# Altium schematic sheet sparkfun-samd21-mini-breakout.SchDoc
size 274 x 209 mm
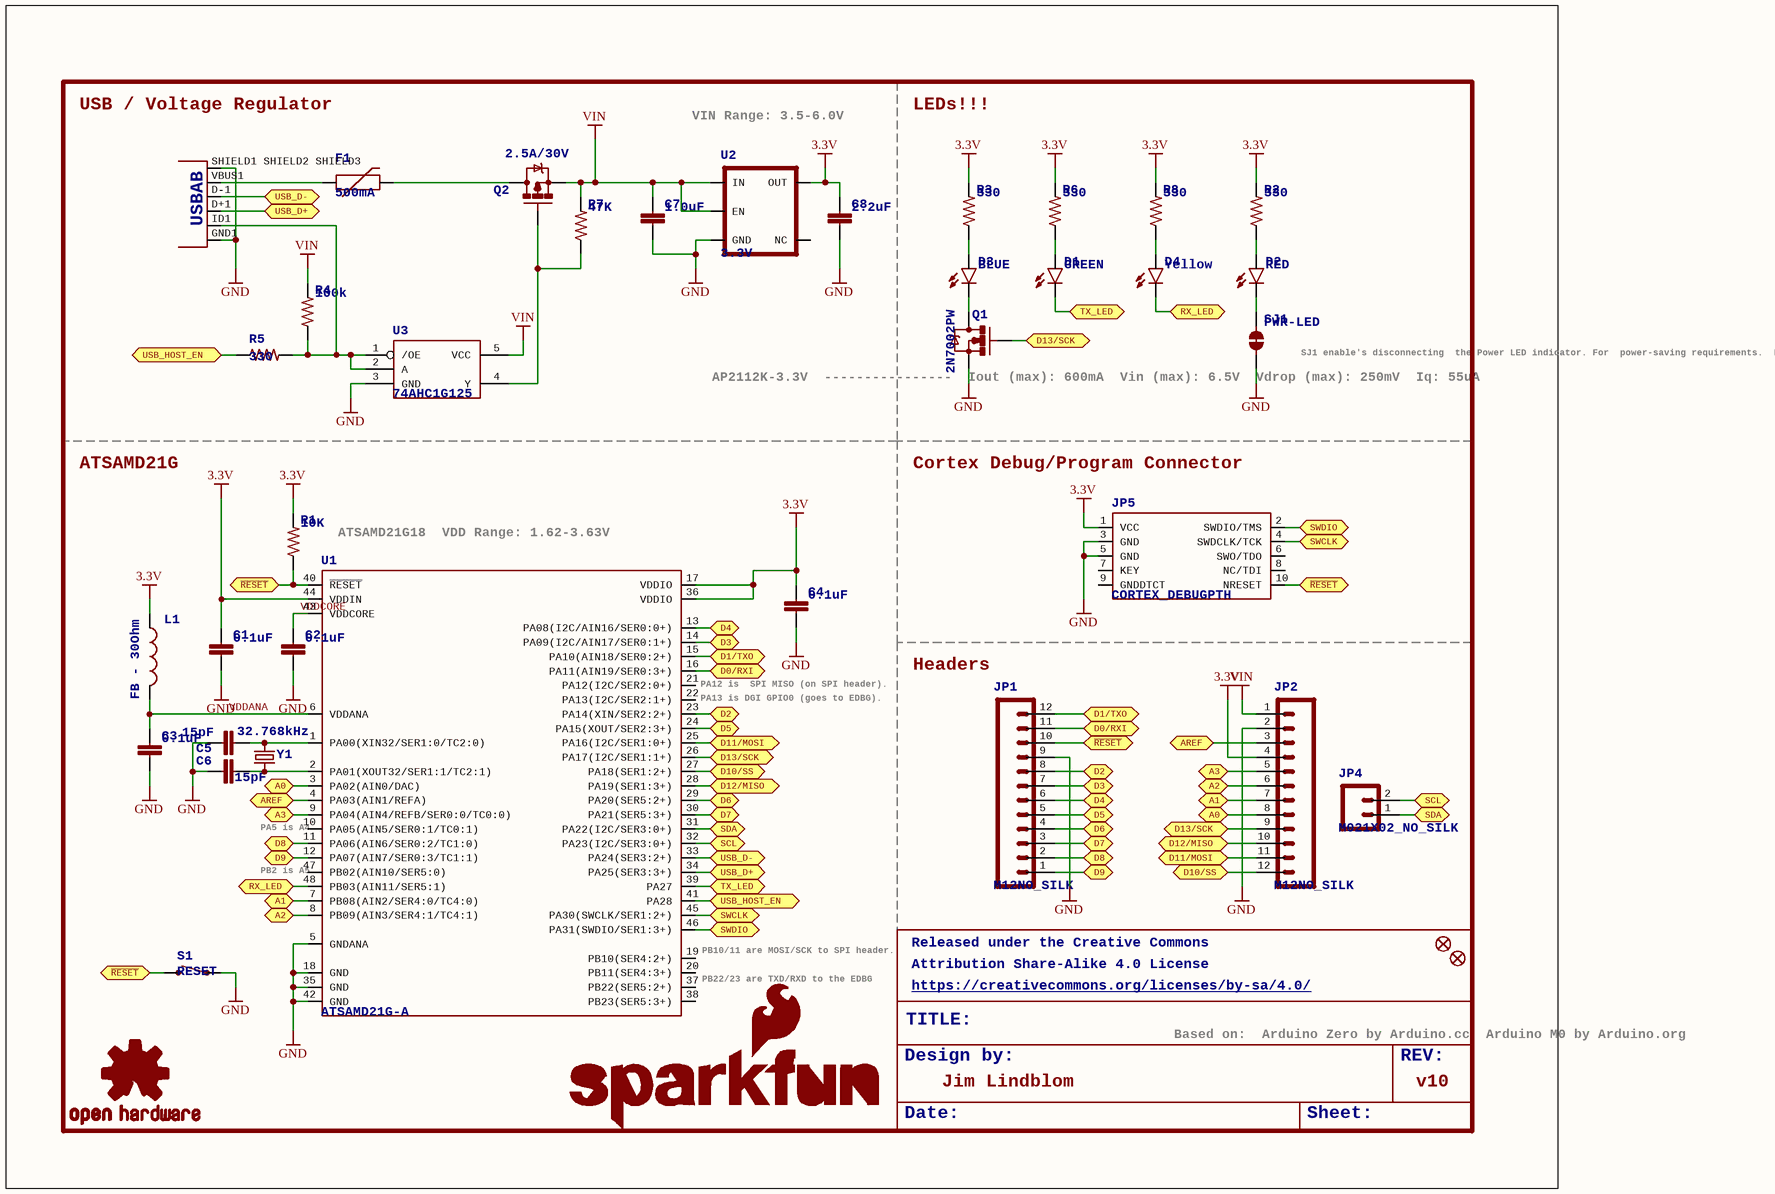
[diagram p0: sparkfun-samd21-mini-breakout.SchDoc]

## Parts
C1  0.1uF  [0402-CAP]
C2  0.1uF  [0402-CAP]
C3  0.1uF  [0402-CAP]
C4  0.1uF  [0402-CAP]
C5  15pF  [0402-CAP]
C6  15pF  [0402-CAP]
C7  1.0uF  [0805-CAP]
C8  2.2uF  [0603-CAP]
D1  GREEN  [LED-0603]
D2  RED  [LED-0603]
D3  BLUE  [LED-0603]
D4  Yellow  [LED-0603]
F1  500mA  [PTC-1206]
FID1  FIDUCIAL1X2  [FIDUCIAL-1X2]  (value not drawn)
FID2  FIDUCIAL1X2  [FIDUCIAL-1X2]  (value not drawn)
JP1  M12NO_SILK  [1X12_NO_SILK]
JP2  M12NO_SILK  [1X12_NO_SILK]
JP3  USB-ABCONN-11794  [USB-AB-MICRO-SMD_V03]  (value not drawn)
JP4  M021X02_NO_SILK  [1X02_NO_SILK]
JP5  CORTEX_DEBUGPTH  [2X5-PTH-1.27MM]
L1  FB - 30Ohm  [0603]
LOGO1  SFE_LOGO_FLAME.1_INCH  [SFE_LOGO_FLAME_.1]  (value not drawn)
LOGO2  OSHW-LOGOS  [OSHW-LOGO-S]  (value not drawn)
LOGO3  SFE_LOGO_NAME_FLAME.1_INCH  [SFE_LOGO_NAME_FLAME_.1]  (value not drawn)
Q1  2N7002PW  [SOT323]
Q2  2.5A/30V  [SOT23-3]
R1  10K  [0603-RES]
R2  330  [0603-RES]
R3  330  [0603-RES]
R4  100k  [0603-RES]
R5  330  [0603-RES]
R6  330  [0603-RES]
R7  47K  [0603-RES]
R8  330  [0603-RES]
S1  RESET  [TACTILE_SWITCH_SMD_4.6X2.8MM]
SJ1  PWR-LED  [PAD-JUMPER-2-NC_BY_TRACE_NO_SILK]
U1  ATSAMD21G-A  [TQFP-48]
U2  3.3V  [SOT23-5]
U3  74AHC1G125  [SOT23-5]
Y1  32.768kHz  [CRYSTAL-SMD-3.2X1.5MM]

## Ports
A0, A1, A2, A3, AREF, D0/RXI, D1/TXO, D2, D3, D4, D5, D6, D7, D8, D9, D10/SS, D11/MOSI, D12/MISO, D13/SCK, RX_LED, SCL, SDA, SWCLK, SWDIO, TX_LED, USB_D+, USB_D-, USB_HOST_EN, ~{RESET}

## Nets
3.3V: C1.1 C4.1 C8.1 JP2.4 JP5.1(VCC) L1.1 R1.2 R2.2 R3.2 R6.2 R8.2 U1.17(VDDIO) U1.36(VDDIO) U1.44(VDDIN) U2.5(OUT)
GND: C1.2 C2.2 C3.2 C4.2 C5.1 C6.2 C7.2 C8.2 JP1.9 JP2.2 JP3.GND1(GND) JP3.SHIELD1_SHIELD2_SHIELD3(SHIELD) JP5.3(GND) JP5.5(GND) Q1.2(S) S1.1_2 SJ1.1 U1.5(GNDANA) U1.18(GND) U1.35(GND) U1.42(GND) U2.2(GND) U3.3(GND)
VIN: C7.1 JP2.1 Q2.2(S) R4.2 R7.2 U2.1(IN) U2.3(EN) U3.5(VCC)
A0: JP2.8 U1.3(PA02(AIN0/DAC)) ; port A0
A1: JP2.7 U1.7(PB08(AIN2/SER4:0/TC4:0)) ; port A1
A2: JP2.6 U1.8(PB09(AIN3/SER4:1/TC4:1)) ; port A2
A3: JP2.5 U1.9(PA04(AIN4/REFB/SER0:0/TC0:0)) ; port A3
AREF: JP2.3 U1.4(PA03(AIN1/REFA)) ; port AREF
D0/RXI: JP1.11 U1.16(PA11(AIN19/SER0:3+)) ; port D0/RXI
D1/TXO: JP1.12 U1.15(PA10(AIN18/SER0:2+)) ; port D1/TXO
D2: JP1.8 U1.23(PA14(XIN/SER2:2+)) ; port D2
D3: JP1.7 U1.14(PA09(I2C/AIN17/SER0:1+)) ; port D3
D4: JP1.6 U1.13(PA08(I2C/AIN16/SER0:0+)) ; port D4
D5: JP1.5 U1.24(PA15(XOUT/SER2:3+)) ; port D5
D6: JP1.4 U1.29(PA20(SER5:2+)) ; port D6
D7: JP1.3 U1.30(PA21(SER5:3+)) ; port D7
D8: JP1.2 U1.11(PA06(AIN6/SER0:2/TC1:0)) ; port D8
D9: JP1.1 U1.12(PA07(AIN7/SER0:3/TC1:1)) ; port D9
D10/SS: JP2.12 U1.27(PA18(SER1:2+)) ; port D10/SS
D11/MOSI: JP2.11 U1.25(PA16(I2C/SER1:0+)) ; port D11/MOSI
D12/MISO: JP2.10 U1.28(PA19(SER1:3+)) ; port D12/MISO
D13/SCK: JP2.9 Q1.1(G) U1.26(PA17(I2C/SER1:1+)) ; port D13/SCK
~{RESET}: JP1.10 JP5.10(NRESET) R1.1 S1.3_4 U1.40(~{RESET}) ; port ~{RESET}
RX_LED: D4.C U1.48(PB03(AIN11/SER5:1)) ; port RX_LED
SCL: JP4.2 U1.32(PA23(I2C/SER3:0+)) ; port SCL
SDA: JP4.1 U1.31(PA22(I2C/SER3:0+)) ; port SDA
SWCLK: JP5.4(SWDCLK/TCK) U1.45(PA30(SWCLK/SER1:2+)) ; port SWCLK
SWDIO: JP5.2(SWDIO/TMS) U1.46(PA31(SWDIO/SER1:3+)) ; port SWDIO
TX_LED: D1.C U1.39(PA27) ; port TX_LED
USB_D+: JP3.D+1(D+) U1.34(PA25(SER3:3+)) ; port USB_D+
USB_D-: JP3.D-1(D-) U1.33(PA24(SER3:2+)) ; port USB_D-
USB_HOST_EN: R5.1 U1.41(PA28) ; port USB_HOST_EN
VDDANA: C3.1 L1.2 U1.6(VDDANA)
VDDCORE: C2.1 U1.43(VDDCORE)
NetC5_2: C5.2 U1.1(PA00(XIN32/SER1:0/TC2:0)) Y1.P$2
NetC6_1: C6.1 U1.2(PA01(XOUT32/SER1:1/TC2:1)) Y1.P$1
NetD1_A: D1.A R6.1
NetD2_A: D2.A R2.1
NetD2_C: D2.C SJ1.2
NetD3_A: D3.A R3.1
NetD3_C: D3.C Q1.3(D)
NetD4_A: D4.A R8.1
NetF1_1: F1.1 JP3.VBUS1(VBUS)
NetF1_2: F1.2 Q2.3(D)
NetJP3_ID1: JP3.ID1(USBID) R4.1 R5.2 U3.1(/OE) U3.2(A)
NetQ2_1: Q2.1(G) R7.1 U3.4(Y)

Not connected (* = marked no-connect by the designer): JP5 6(SWO/TDO) 7(KEY) 8(NC/TDI) 9(GNDDTCT); U1 10(PA05(AIN5/SER0:1/TC0:1)) 19(PB10(SER4:2+)) 20(PB11(SER4:3+)) 21(PA12(I2C/SER2:0+)) 22(PA13(I2C/SER2:1+)) 37(PB22(SER5:2+)) 38(PB23(SER5:3+)) 47(PB02(AIN10/SER5:0)); U2 4(NC)

## Notes on the sheet
- USB / Voltage Regulator
- VIN Range: 3.5-6.0V
- LEDs!!!
- (near SJ1) SJ1 enable's disconnecting
  the Power LED indicator. For
  power-saving requirements.
  Default: closed.
- AP2112K-3.3V
  ----------------
  Iout (max): 600mA
  Vin (max): 6.5V
  Vdrop (max): 250mV
  Iq: 55uA
- ATSAMD21G
- (near JP5) Cortex Debug/Program Connector
- ATSAMD21G18
  VDD Range: 1.62-3.63V
- (near U1) PA12 is  SPI MISO (on SPI header).
- (near U1) PA13 is DGI GPIO0 (goes to EDBG).
- Headers
- (near U1) PA5 is A4
- (near U1) PB2 is A5
- (near U1) PB22/23 are TXD/RXD to the EDBG
- (near U1) PB10/11 are MOSI/SCK to SPI header.
- Released under the Creative Commons
- Attribution Share-Alike 4.0 License
- https://creativecommons.org/licenses/by-sa/4.0/
- Design by:
- TITLE:
- Based on:
  Arduino Zero by Arduino.cc
  Arduino M0 by Arduino.org
- REV:
- Date:
- Jim Lindblom
- Sheet:
- v10

## Library data of the parts
C1-C4 = 0.1UF-16V(+-10%)(0402): PROD_ID: CAP-12416; VALUE: 0.1uF
C5 C6 = 15PF-50V(+-5%)(0402)
C7 = 1.0UF-25V-+80/-20(0805)": CAP-11625; PROD_ID: CAP-11625; VALUE: 1.0uF
C8 = 2.2UF-10V-20%(0603): CAP-07888; PROD_ID: CAP-07888; VALUE: 2.2uF
D1 = LED-GREEN0603: Various green LEDs  Green LEDs used in SFE Production  0603- DIO-00821 LARGE- DIO-00862 LILYPAD- DIO-09910; PROD_ID: DIO-00821; VALUE: GREEN
D2 = LED-RED0603: Assorted Red LEDs LilyPad 1206- DIO-09912 1206- DIO-00809 0603- DIO-00819 "SMART" means more efficient and expensive; PROD_ID: DIO-00819; VALUE: RED
D3 = LED-BLUE0603: Blue LEDs for production use    Various blue LEDs stocked by SparkFun production 0603 - DIO-08575 Rebel - DIO-09553 1206 - DIO-09911; PROD_ID: DIO-08575; VALUE: BLUE
D4 = LED-YELLOW0603: Yellow SMD LEDs LilyPad 1206- DIO-09909 0603- DIO-09003 "SMART" means more efficient and expensive; PROD_ID: DIO-09003; VALUE: Yellow
F1 = PTCSMD: Resettable Fuse PTCResettable Fuse. Spark Fun Electronics SKU : COM-08357; PROD_ID: RES-11150
FID1 FID2 = FIDUCIAL1X2: Fiducial Alignment PointsVarious fiducial points for machine vision alignment.
JP1 JP2 = M12NO_SILK: Header 12Standard 12-pin 0.1" header. Use with straight break away headers (SKU : PRT-00116), right angle break away headers (PRT-00553), swiss pins (PRT-00743), machine pins (PRT-00117), and female headers (PRT-00115).
JP3 = USB-ABCONN-11794: This is a USB AB connector that is compatible with USB OTG. i.e. this connector can serve as a host or device; PROD_ID: CONN-11794; USBAB: USBAB
JP4 = M021X02_NO_SILK: Standard 2-pin 0.1" header. Use with  - straight break away headers ( PRT-00116) - right angle break away headers (PRT-00553) - swiss pins (PRT-00743) - machine pins (PRT-00117) - female headers (PRT-00115)   Molex polarized connector foot print use with: PRT-08233 with associated crimp pins and housings.  2.54_SCREWTERM for use with  PRT-10571.  3.5mm Screw Terminal footprints for  PRT-08084  5mm Screw Terminal footprints for use with PRT-08432
JP5 = CORTEX_DEBUGPTH: Cortex Debug Connector    Datasheet
L1 = INDUCTOR0603: Inductors   Basic Inductor/Choke - 0603 and 1206. Footprints are not proven and vary greatly between part numbers. INDUCTOR POWER 3.3UH 4.0A SMD 0.197" L x 0.197" W x 0.177" H (5.00mm x 5.00mm x 4.50mm)
LOGO1 = SFE_LOGO_FLAME.1_INCH: SFE Logo, flame only    This is the SparkFun flame logo. The logo on the schematic will always be the same size; the package variant is the height of the flame. Default layer for the logo on the board is tSilk.
LOGO2 = OSHW-LOGOS: Open Source Hardware Logo This logo indicates the piece of hardware it is found on incorporates a OSHW license and/or adheres to the definition of open source hardware found here: http://freedomdefined.org/OSHW
LOGO3 = SFE_LOGO_NAME_FLAME.1_INCH: SFE Logo, name and flame    This is the SparkFun full logo. The logo on the schematic will always be the same size; the package variant is the height of the flame part of the logo. Default layer for the logo on the board is tSilk.
Q1 = MOSFET-NCHANNEL2N7002PW: Common NMOSFET Parts      MFG P/NStore IDProd ID   FDD8780		TRANS-09984	   SI7820DN		TRANS-11055	   FDS6630A		IC-08089	   2N7002PW		TRANS-11151	   FQP30N06L	  COM-10213	TRANS-10060	   BSS123LT1G		TRANS-08345	   BSS138		TRANS-00830	   BS170			   2N7000
Q2 = MOSFET-PCHANNELDMG2307L: Generic PMOSFET    IRLML2244 - TRANS-11153 (SOT-23 -20V -4.3A) (1.Gate 2.Source 3.Drain)     FQP27P06 - COM-10349(TO-220 -60V -27A) (1.Gate 2.Source 3.Drain)
R1 = 10KOHM-1/10W-1%(0603)0603: RES-00824; PROD_ID: RES-00824; VALUE: 10K
R2 R3 R5 R6 R8 = 330OHM1/10W1%(0603): RES-00818; PROD_ID: RES-00818; VALUE: 330
R4 = 100KOHM-1/10W-1%(0603): RES-07828; PROD_ID: RES-07828; VALUE: 100k
R7 = 47KOHM1/10W1%(0603): RES-07871; PROD_ID: RES-07871; VALUE: 47K
S1 = SWITCH-MOMENTARY-2SMD-4.6X2.8MM: Various NO switches- pushbuttons, reed, etc; PROD_ID: SWCH-13065
SJ1 = JUMPER-PAD-2-NC_BY_TRACENO_SILK
U1 = ATSAMD21G-A: Atmel SAMD21G SMART ARM-Based Microcontroller    The Atmel ® | SMART ™ SAM D21 is a series of low-power microcontrollers using the 32-bit ARM ® Cortex ® -M0+ processor, and ranging from 32- to 64-pins with up to 256KB Flash and 32KB of SRAM. The SAM D21 devices operate at a maximum frequency of 48MHz and reach 2.46 CoreMark/MHz. They are designed for simple and intuitive migration with identical peripheral modules, hex compatible code, identical linear address map and pin compatible migration paths between all devices in the product series. All devices include intelligent and flexible peripherals, Atmel Event System for inter-peripheral signaling, and support for capacitive touch button, slider and wheel user interfaces.; PROD_ID: IC-13064
U2 = V_REG_AP2112K-3.3V: AP2112 - 600mA CMOS LDO Regulator w/ Enable    The AP2112 is CMOS process low dropout linear regulator with enable function, the regulator delivers a guaranteed 600mA (min.) continuous load current.   Features  Output Voltage Accuracy: ±1.5%   Output Current: 600mA (Min.)   Foldback Short Current Protection: 50mA   Enable Function to Turn ON/OFF VOUT  Low Dropout Voltage (3.3V): 250mV (Typ.) @IOUT=600mA   Excellent Load Regulation: 0.2%/A (Typ.)   Excellent Line Regulation: 0.02%/V (Typ.)   Low Quiescent Current: 55μA (Typ.)  Low Standby Current: 0.01μA (Typ.)  Low Output Noise: 50μVRMS   PSRR: 100Hz -65dB, 1kHz -65dB    OTSD Protection   Stable  with  1.0μF Flexible Cap: Ceramic, Tantalum and Aluminum Electrolytic   Operation Temperature Range: -40°C to 85°C   ESD: MM 400V, HBM 4000V; PROD_ID: VREG-12457; VALUE: 3.3V
U3 = 74AHC1G125: Single bus buffer gate with 3-state output; PROD_ID: IC-11920
Y1 = CRYSTAL3.2X1.5MM: Various standard crystals. Proven footprints.